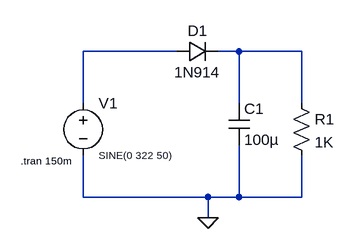
[diagram p0: schematic Half wave rectifier.asc]
Half wave rectifier.asc, the LTspice schematic file:
Version 4
SHEET 1 880 680
WIRE 160 64 16 64
WIRE 256 64 224 64
WIRE 352 64 256 64
WIRE 16 144 16 64
WIRE 256 144 256 64
WIRE 352 144 352 64
WIRE 16 288 16 224
WIRE 208 288 16 288
WIRE 256 288 256 208
WIRE 256 288 208 288
WIRE 352 288 352 224
WIRE 352 288 256 288
WIRE 208 320 208 288
FLAG 208 320 0
SYMBOL voltage 16 128 R0
WINDOW 3 24 96 Left 1
WINDOW 123 0 0 Left 0
WINDOW 39 0 0 Left 0
SYMATTR Value SINE(0 322 50)
SYMATTR InstName V1
SYMBOL diode 160 80 R270
WINDOW 0 32 32 VTop 2
WINDOW 3 0 32 VBottom 2
SYMATTR InstName D1
SYMATTR Value 1N914
SYMBOL res 336 128 R0
SYMATTR InstName R1
SYMATTR Value 1K
SYMBOL cap 240 144 R0
SYMATTR InstName C1
SYMATTR Value 100µ
SYMATTR SpiceLine V=400
TEXT -80 232 Left 1 !.tran 150m

The netlist it stands for:
* Half wave rectifier.asc
V1 N001 0 SINE(0 322 50)
D1 N001 N002 1N914
R1 N002 0 1K
C1 N002 0 100µ V=400
.model D D
.lib standard.dio
.tran 150m
.backanno
.end